# Altium schematic sheet H1N1.SchDoc: Hacheur moteur - LMD18200
size A3; Author: B.Labbe; CompanyName: Oufffteam; DrawnBy: B.Labbe; Engineer: B.Labbe; Organization: Oufffteam; Address1: L3, 12a Rodborough Rd; Address2: Frenchs Forest; Address3: NSW; Address4: Australia 2086; Revision: A; SheetNumber: 1; SheetTotal: 1
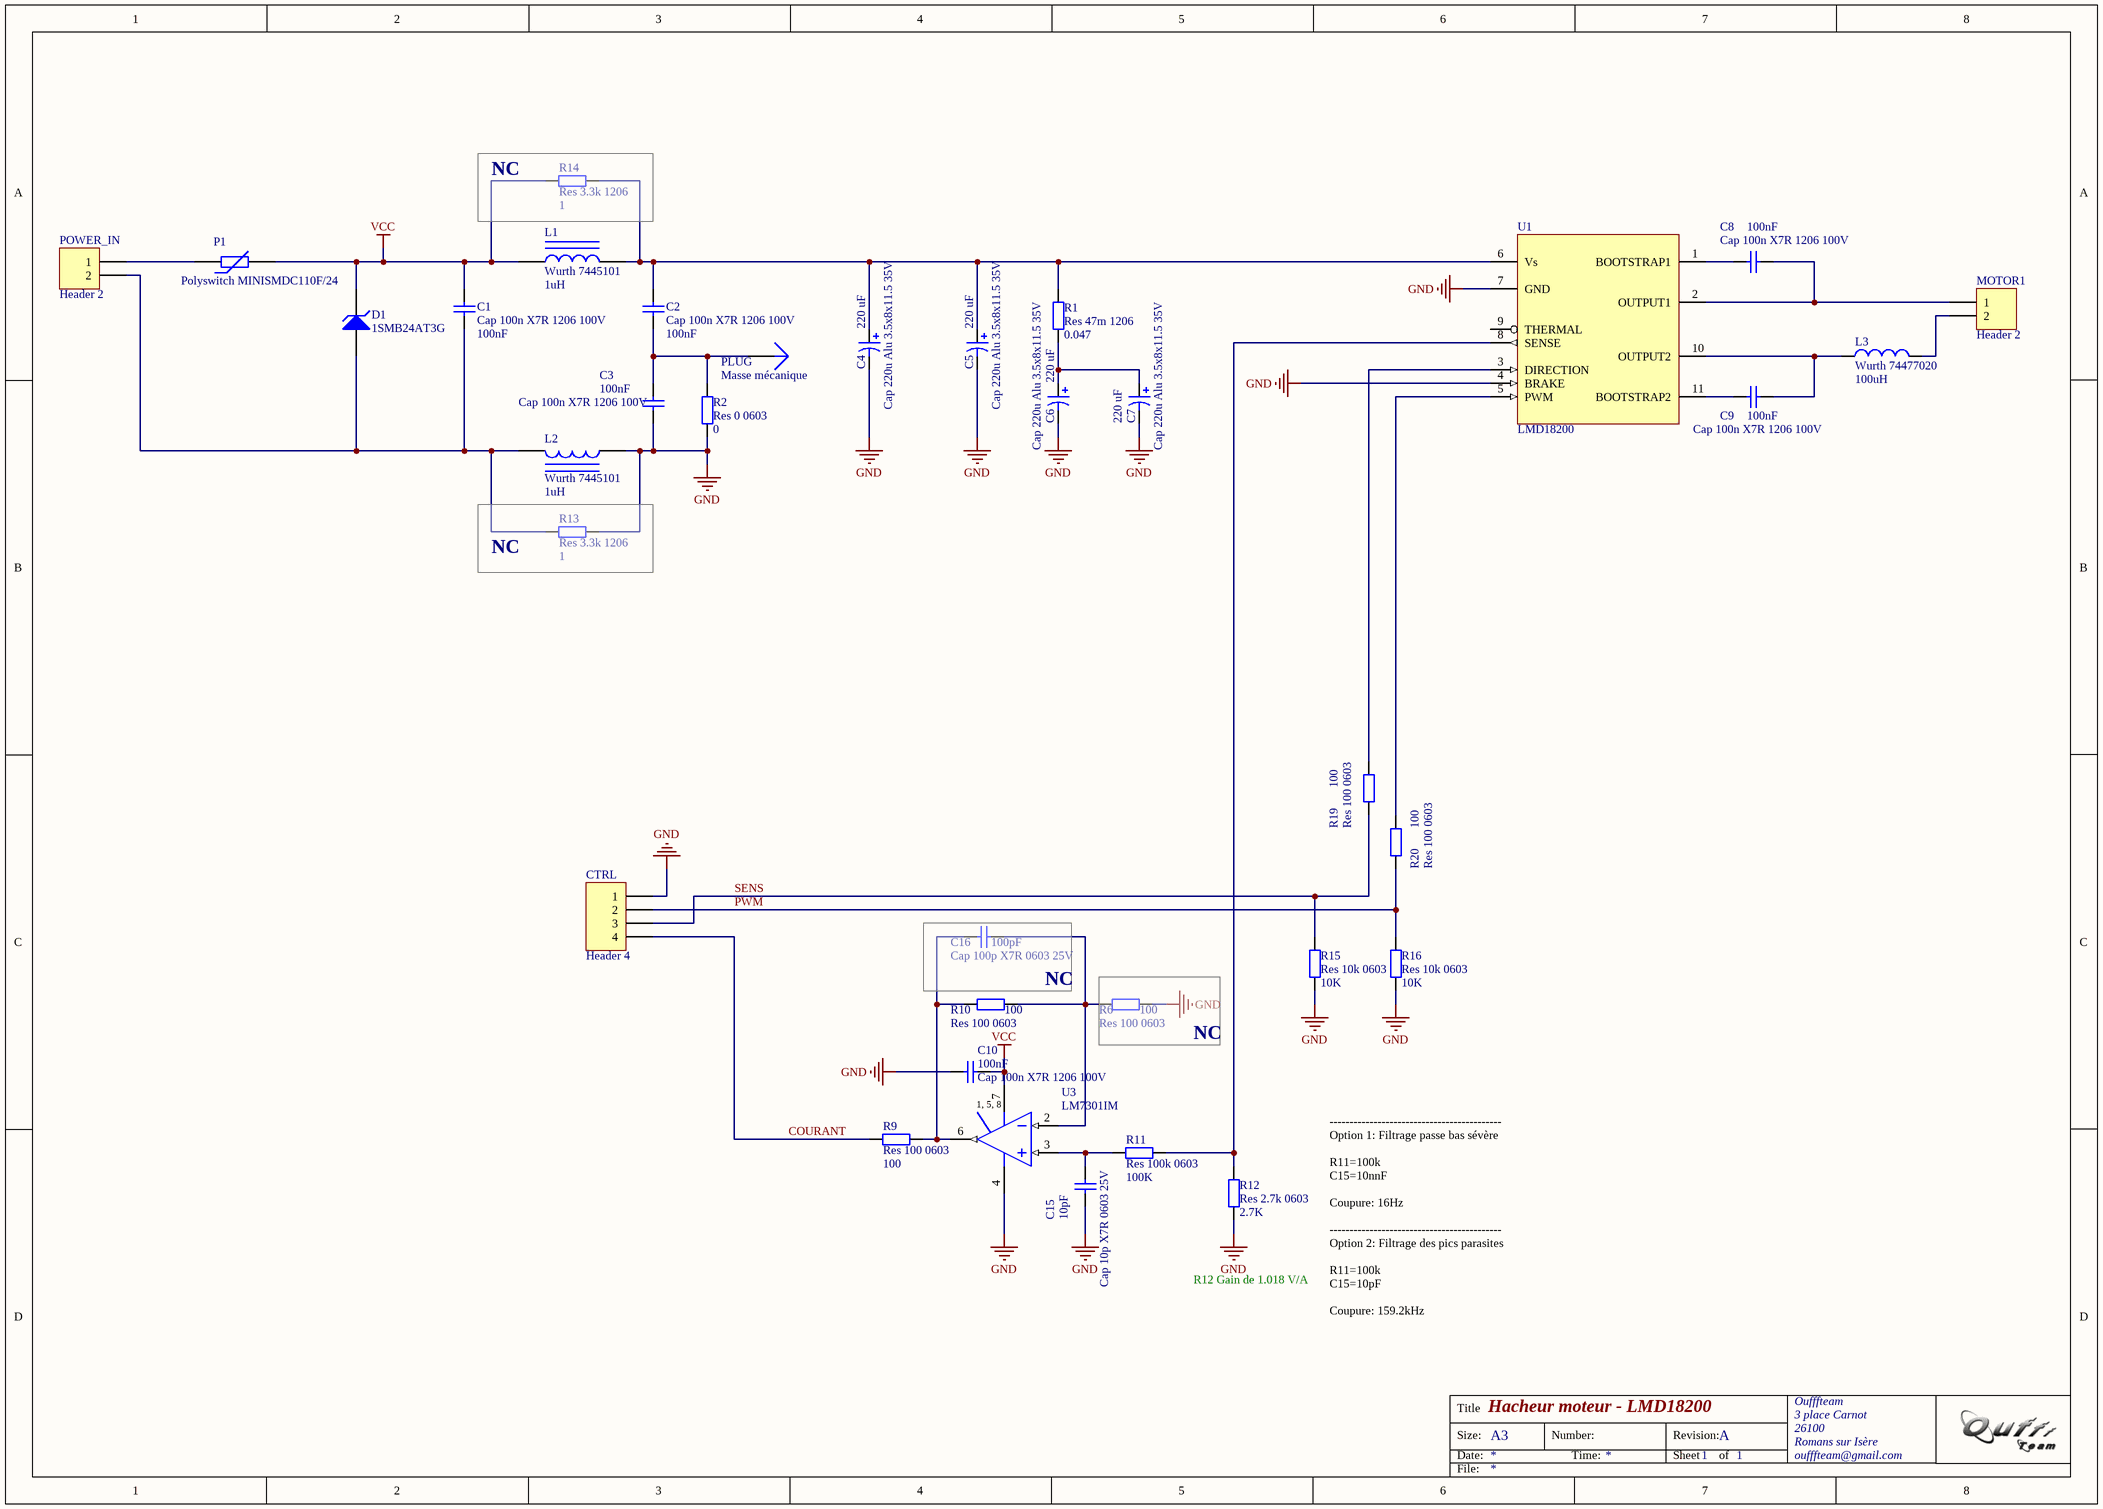
[diagram p0: H1N1.SchDoc]

## Parts
C1  Cap 100n X7R 1206 100V  value 100nF  [3216[1206]]
C2  Cap 100n X7R 1206 100V  value 100nF  [3216[1206]]
C3  Cap 100n X7R 1206 100V  value 100nF  [3216[1206]]
C4  Cap 220u Alu 3.5x8x11.5 35V  value 220 uF  [CAPPR3.5-8X11.5]
C5  Cap 220u Alu 3.5x8x11.5 35V  value 220 uF  [CAPPR3.5-8X11.5]
C6  Cap 220u Alu 3.5x8x11.5 35V  value 220 uF  [CAPPR3.5-8X11.5]
C7  Cap 220u Alu 3.5x8x11.5 35V  value 220 uF  [CAPPR3.5-8X11.5]
C8  Cap 100n X7R 1206 100V  value 100nF  [3216[1206]]
C9  Cap 100n X7R 1206 100V  value 100nF  [3216[1206]]
C10  Cap 100n X7R 1206 100V  value 100nF  [3216[1206]]
C15  Cap 10p X7R 0603 25V  value 10pF  [1608[0603]]
C16  Cap 100p X7R 0603 25V  value 100pF  [1608[0603]]
CTRL  Header 4  [HDR1X4]
D1  1SMB24AT3G  [SMB]
L1  Wurth 7445101  value 1uH  [7445101]
L2  Wurth 7445101  value 1uH  [7445101]
L3  Wurth 74477020  value 100uH  [74477020]
MOTOR1  Header 2  [Bornier 3.85]
P1  Polyswitch MINISMDC110F/24  [1812]
PLUG  Masse mécanique  [PIN1]
POWER_IN  Header 2  [Bornier 3.85]
R1  Res 47m 1206  value 0.047  [3216[1206]]
R2  Res 0 0603  value 0  [1608[0603]]
R6  Res 100 0603  value 100  [1608[0603]]
R9  Res 100 0603  value 100  [1608[0603]]
R10  Res 100 0603  value 100  [1608[0603]]
R11  Res 100k 0603  value 100K  [1608[0603]]
R12  Res 2.7k 0603  value 2.7K  [1608[0603]]
R13  Res 3.3k 1206  value 1  [3216[1206]]
R14  Res 3.3k 1206  value 1  [3216[1206]]
R15  Res 10k 0603  value 10K  [1608[0603]]
R16  Res 10k 0603  value 10K  [1608[0603]]
R19  Res 100 0603  value 100  [1608[0603]]
R20  Res 100 0603  value 100  [1608[0603]]
U1  LMD18200  [LMD18200]
U3  LM7301IM  [M08A_M]

## Blocks framed on the sheet
NC: R14
NC: R13
NC: C16
NC: R6

## Nets
GND: C3.1 C4.2 C5.2 C6.2 C7.2 C10.1 C15.1 CTRL.1 L2.1 R2.1 R6.2 R12.1 R13.2 R15.1 R16.1 U1.4(BRAKE) U1.7(GND) U3.4(V-)
VCC: C1.2 C10.2 D1.2(K) L1.1 P1.2 R14.1 U3.7(V+)
COURANT: CTRL.4 R9.1
PWM: CTRL.2 R16.2 R20.1
SENS: CTRL.3 R15.2 R19.1
NetC1_1: C1.1 D1.1(A) L2.2 POWER_IN.2 R13.1
NetC2_1: C2.1 C3.2 PLUG.1 R2.2
NetC2_2: C2.2 C4.1 C5.1 L1.2 R1.2 R14.2 U1.6(Vs)
NetC6_1: C6.1 C7.1 R1.1
NetC8_1: C8.1 U1.1(BOOTSTRAP1)
NetC8_2: C8.2 MOTOR1.1 U1.2(OUTPUT1)
NetC9_1: C9.1 U1.11(BOOTSTRAP2)
NetC9_2: C9.2 L3.1 U1.10(OUTPUT2)
NetC15_2: C15.2 R11.2 U3.3(IN+)
NetC16_1: C16.1 R9.2 R10.1 U3.6(OUT)
NetC16_2: C16.2 R6.1 R10.2 U3.2(IN-)
NetL3_2: L3.2 MOTOR1.2
NetP1_1: P1.1 POWER_IN.1
NetR11_1: R11.1 R12.2 U1.8(SENSE)
NetR19_2: R19.2 U1.3(DIRECTION)
NetR20_2: R20.2 U1.5(PWM)

Not connected (* = marked no-connect by the designer): U1 9(THERMAL)

## Notes on the sheet
- R12 Gain de 1.018 V/A
- -------------------------------------------
  Option 1: Filtrage passe bas sévère
  R11=100k
  C15=10nnF
  Coupure: 16Hz
  -------------------------------------------
  Option 2: Filtrage des pics parasites
  R11=100k
  C15=10pF
  Coupure: 159.2kHz
- Title
- Size:
- Date:
- A3
- Number:
- Time:
- Revision:
- Sheet
- of
- Oufffteam
- 3 place Carnot
- 26100
- Romans sur Isère
- oufffteam@gmail.com
- File:
- (in symbol LM7301IM) 1, 5, 8

## Library data of the parts
C1-C3 C8-C10 C15 C16 = Cap: Capacitor; Published: 8-Jun-2000; LatestRevisionDate: 17-Jul-2002; LatestRevisionNote: Re-released for DXP Platform.; PackageReference: RAD-0.3; Publisher: Altium Limited
C4-C7 = Cap Pol1: Polarized Capacitor (Radial); Published: 8-Jun-2000; LatestRevisionDate: 17-Jul-2002; LatestRevisionNote: Re-released for DXP Platform.; PackageReference: RB7.6-15; Publisher: Altium Limited
CTRL = Header 4: Header, 4-Pin; LatestRevisionDate: 17-Jul-2002; LatestRevisionNote: Re-released for DXP Platform.; Publisher: Altium Limited
D1 = D Zener: Zener Diode; Published: 8-Jun-2000; LatestRevisionDate: 17-Jul-2002; LatestRevisionNote: Re-released for DXP Platform.; PackageReference: DIODE-0.7; Publisher: Altium Limited
L1 L2 = Inductor Iron: Magnetic-Core Inductor; Published: 24-Mar-1999; LatestRevisionDate: 17-Jul-2002; LatestRevisionNote: Re-released for DXP Platform.; PackageReference: AXIAL-0.9; Publisher: Altium Limited
L3 = Inductor: Code_IEC: 1005; Published: 8-Jun-2000; LatestRevisionDate: 17-Jul-2002; LatestRevisionNote: Re-released for DXP Platform.; PackageReference: 0402-A; Publisher: Altium Limited; Code_JEITA: 0402
MOTOR1 POWER_IN = Header 2: Header, 2-Pin; LatestRevisionDate: 17-Jul-2002; LatestRevisionNote: Re-released for DXP Platform.; Publisher: Altium Limited
P1 = Res Varistor: Varistor (Voltage-Sensitive Resistor); Published: 24-Mar-1999; LatestRevisionDate: 04-Mar-2005; LatestRevisionNote: PCB Footprint replaced.; PackageReference: 6-0805; Publisher: Altium Limited
PLUG = Plug: LatestRevisionDate: 17-Jul-2002; LatestRevisionNote: Re-released for DXP Platform.; Publisher: Altium Limited
R1 R2 R6 R9-R16 R19 R20 = Res2: Resistor; Published: 8-Jun-2000; LatestRevisionDate: 17-Jul-2002; LatestRevisionNote: Re-released for DXP Platform.; PackageReference: AXIAL-0.4; Publisher: Altium Limited
U1 = LMD18200: 3A, 55V H-Bridge
U3 = LM7301IM: Low-Power, 4MHZ GBW, Rail-to-Rail Input-Output Operational Amplifier in TinyPak Package; Note: Pins 1, 5 and 8 are N.C.; Published: 15-Apr-2002; LatestRevisionDate: 13-Apr-2006; LatestRevisionNote: IPC-7351 Footprint Added.; DatasheetVersion: Aug-1999; PackageVersion: Sep-1997; PackageReference: M08A; Publisher: Altium Limited; PackageDescription: 8-Pin Small Outline Integrated Circuit 1.27 mm Pitch; Code_JEDEC: MS-012-AA; Code_IPC: SOIC127P600-8; ComponentLink1Description: Manufacturer Link; ComponentLink1URL: http://www.national.com/; ComponentLink2Description: Datasheet; ComponentLink2URL: http://www.national.com/ds.cgi/LM/LM7301.pdf; ComponentLink3Description: URL Link1; ComponentLink3URL: http://www.national.com/pf/LM/LM7301.html